# Altium schematic sheet 总图.SchDoc
size A3
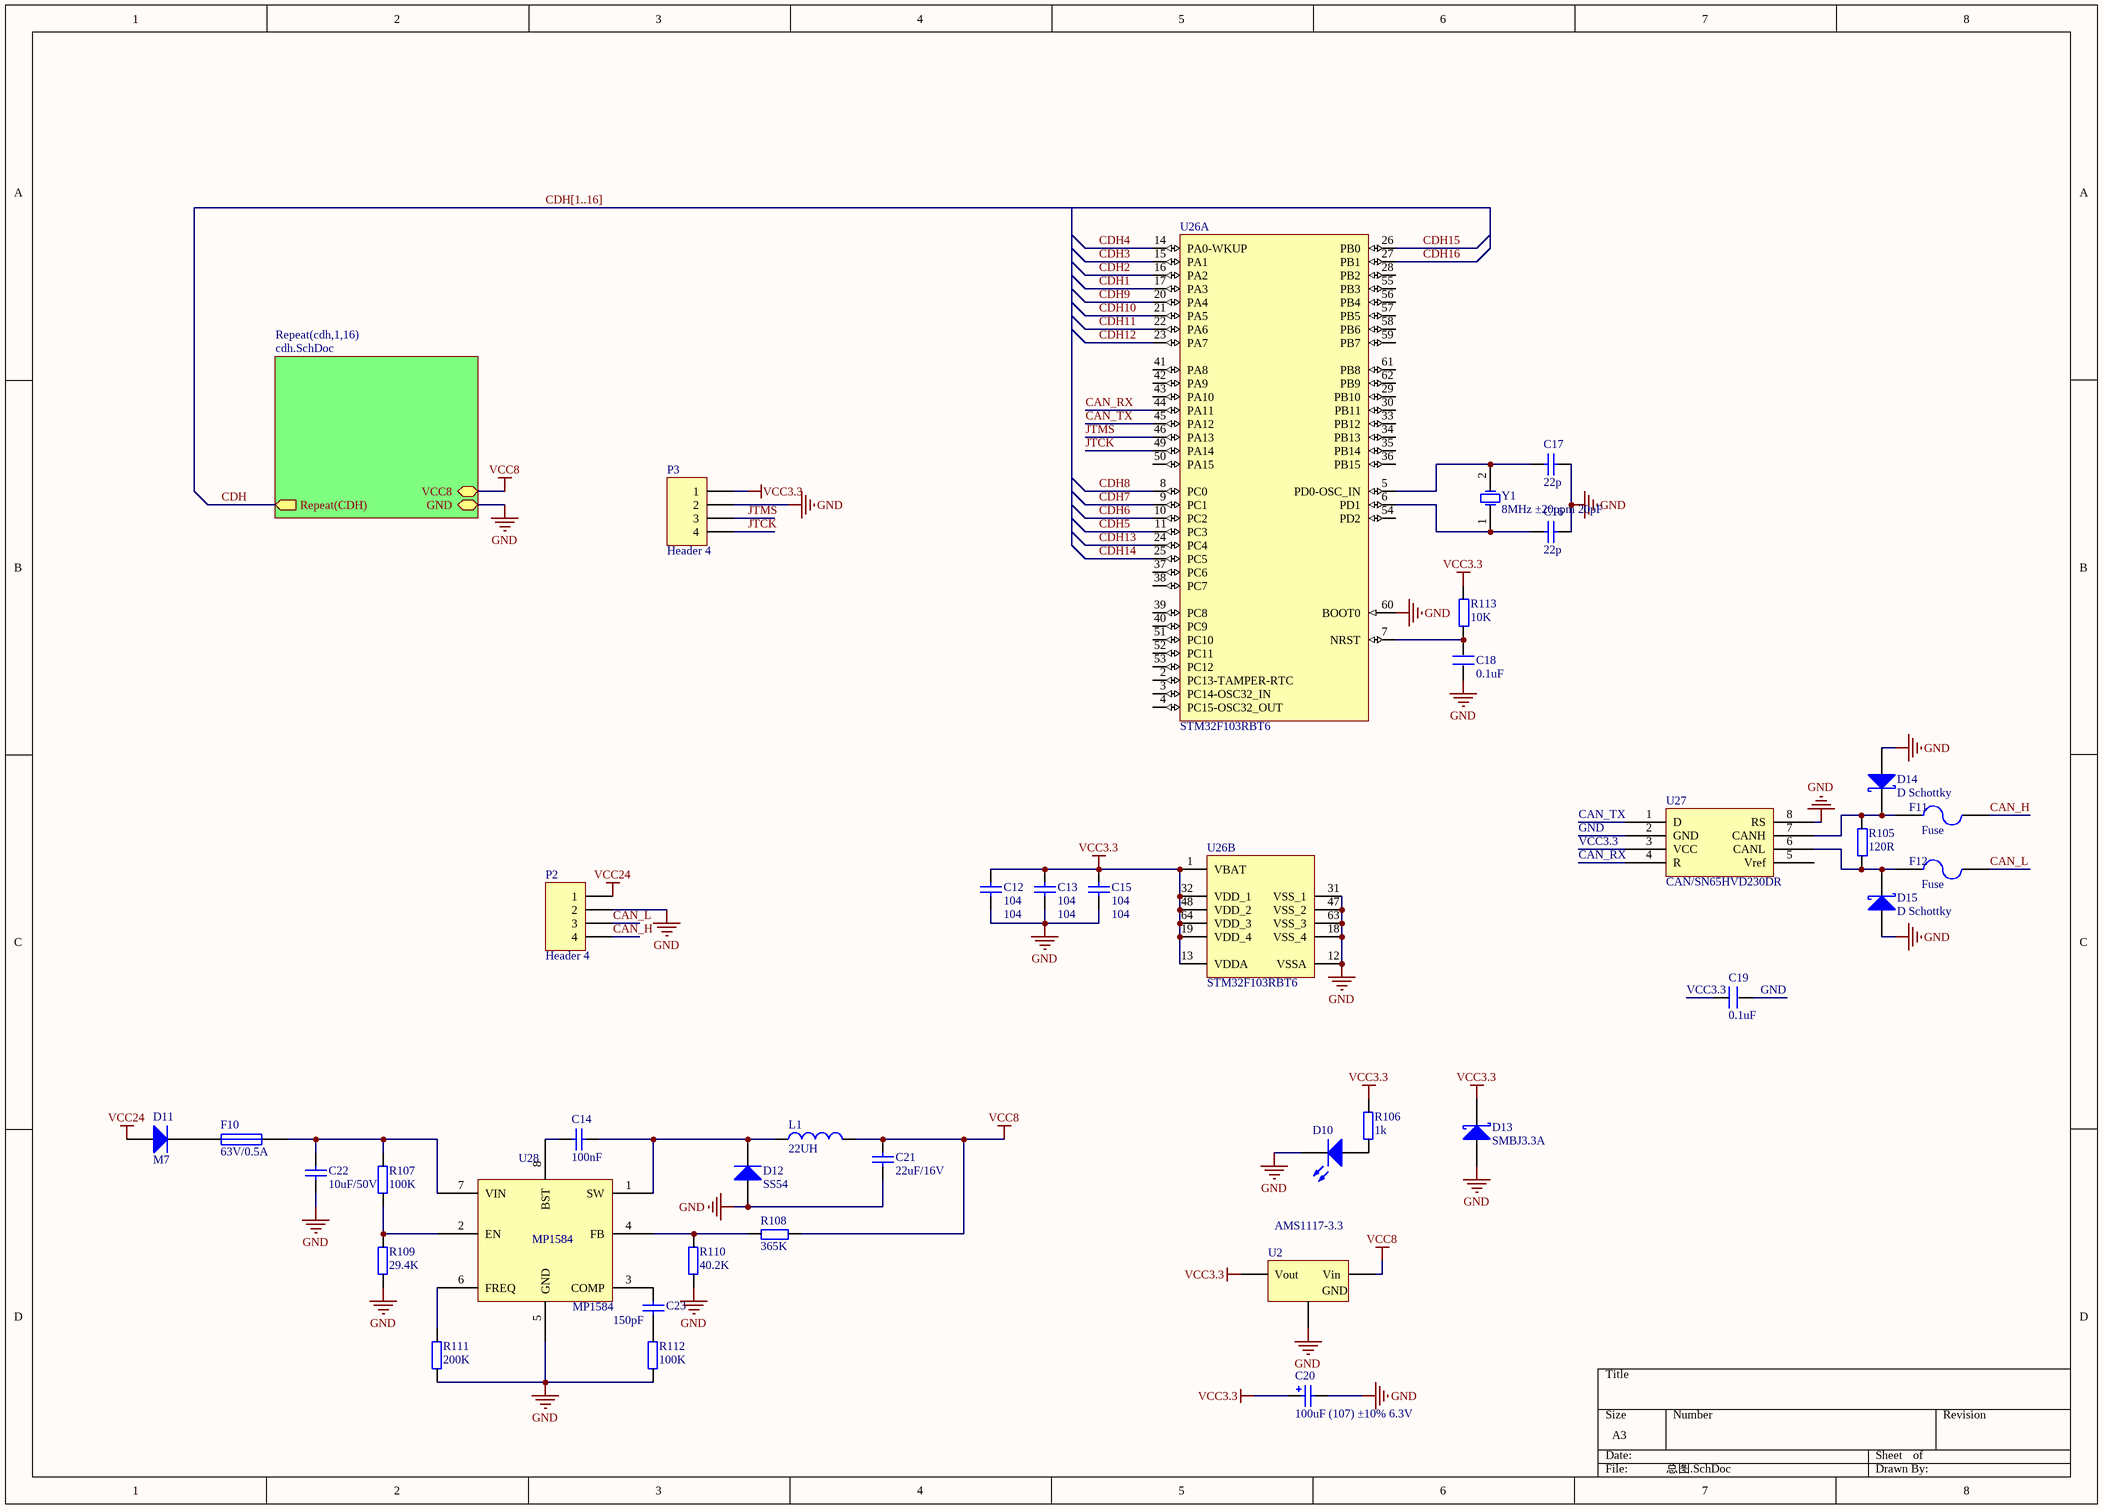
[diagram p0: 总图.SchDoc]

## Parts
C12  104  [0603-CAP]
C13  104  [0603-CAP]
C14  value 100nF  [0603-CAP]  (hidden comment: 0.1uF)
C15  104  [0603-CAP]
C16  22p  [0603-CAP]
C17  22p  [0603-CAP]
C18  0.1uF  [0603-CAP]
C19  0.1uF  [0603-CAP]
C20  100uF (107) ±10% 6.3V  [CASE-B_3528]
C21  value 22uF/16V  [1206]  (hidden comment: 0.1uF)
C22  value 10uF/50V  [1206]  (hidden comment: 0.1uF)
C23  value 150pF  [0603-CAP]  (hidden comment: 0.1uF)
D10  LED0  [LC-0805_LED_S1]  (value not drawn)
D11  M7  [SMA(DO-214AC)_S1]
D12  SS54  [SMA(DO-214AC)_S1]
D13  SMBJ3.3A  [SMB]
D14  D Schottky  [SMB]
D15  D Schottky  [SMB]
F10  63V/0.5A  [1206]
F11  Fuse  [12Z-2010]
F12  Fuse  [12Z-2010]
L1  22UH  [L-7*7*4mm-S]
P2  Header 4  [DZ-4-3.5]
P3  Header 4  [HDR1X4]
R105  120R  [0603]
R106  1k  [0603]
R107  100K  [0603]
R108  365K  [0603]
R109  29.4K  [0603]
R110  40.2K  [0603]
R111  200K  [0603]
R112  100K  [0603]
R113  10K  [0603]
U2  AMS1117-3.3  [SOT-223]
U26  STM32F103RBT6  [LQFP-64_10x10x05P]  (parts A,B of 2)
U27  CAN/SN65HVD230DR  [SOIC-8_150mil]
U28  MP1584  [SO-8]
Y1  8MHz ±20ppm 20pF  [SMD-5032_2P]

## Sub-sheets
Repeat(cdh,1,16) = cdh.SchDoc: GND (bidir), VCC8 (bidir), Repeat(CDH) (out)

## Nets
GND: C12.2 C13.2 C15.2 C16.2 C17.2 C18.1 C19.2 C20.2 C21.1 C22.2 D10.K D12.1(A) D13.1(A) D14.1(A) D15.1(A) P2.2 P3.2 R109.2 R110.2 R111.2 R112.2 U2.1(GND) U26.12(VSSA) U26.18(VSS_4) U26.31(VSS_1) U26.47(VSS_2) U26.60(BOOT0) U26.63(VSS_3) U27.2(GND) U27.8(RS) U28.5(GND) ; sheet Repeat(cdh,1,16)/GND
VCC3.3: C12.1 C13.1 C15.1 C19.1 C20.1 D13.2(K) P3.1 R106.1 R113.2 U2.2(Vout) U26.1(VBAT) U26.13(VDDA) U26.19(VDD_4) U26.32(VDD_1) U26.48(VDD_2) U26.64(VDD_3) U27.3(VCC)
VCC8: C21.2 L1.2 R108.2 U2.3(Vin) ; sheet Repeat(cdh,1,16)/VCC8
VCC24: D11.1(A) P2.1
CAN_H: F11.1 P2.4
CAN_L: F12.1 P2.3
CAN_RX: U26.44(PA11) U27.4(R)
CAN_TX: U26.45(PA12) U27.1(D)
CDH: sheet Repeat(cdh,1,16)/Repeat(CDH)
CDH1: U26.17(PA3)
CDH2: U26.16(PA2)
CDH3: U26.15(PA1)
CDH4: U26.14(PA0-WKUP)
CDH5: U26.11(PC3)
CDH6: U26.10(PC2)
CDH7: U26.9(PC1)
CDH8: U26.8(PC0)
CDH9: U26.20(PA4)
CDH10: U26.21(PA5)
CDH11: U26.22(PA6)
CDH12: U26.23(PA7)
CDH13: U26.24(PC4)
CDH14: U26.25(PC5)
CDH15: U26.26(PB0)
CDH16: U26.27(PB1)
JTCK: P3.4 U26.49(PA14)
JTMS: P3.3 U26.46(PA13)
NetC14_1: C14.1 D12.2(K) L1.1 U28.1(SW)
NetC14_2: C14.2 U28.8(BST)
NetC16_1: C16.1 U26.6(PD1) Y1.1(OSC1)
NetC17_1: C17.1 U26.5(PD0-OSC_IN) Y1.2(OSC2)
NetC18_2: C18.2 R113.1 U26.7(NRST)
NetC22_1: C22.1 F10.2 R107.1 U28.7(VIN)
NetC23_1: C23.1 R112.1
NetC23_2: C23.2 U28.3(COMP)
NetD10_A: D10.A R106.2
NetD11_2: D11.2(K) F10.1
NetD14_2: D14.2(K) F11.2 R105.2 U27.7(CANH)
NetD15_2: D15.2(K) F12.2 R105.1 U27.6(CANL)
NetR107_2: R107.2 R109.1 U28.2(EN)
NetR108_1: R108.1 R110.1 U28.4(FB)
NetR111_1: R111.1 U28.6(FREQ)

Not connected (* = marked no-connect by the designer): U26 2(PC13-TAMPER-RTC) 3(PC14-OSC32_IN) 4(PC15-OSC32_OUT) 28(PB2) 29(PB10) 30(PB11) 33(PB12) 34(PB13) 35(PB14) 36(PB15) 37(PC6) 38(PC7) 39(PC8) 40(PC9) 41(PA8) 42(PA9) 43(PA10) 50(PA15) 51(PC10) 52(PC11) 53(PC12) 54(PD2) 55(PB3) 56(PB4) 57(PB5) 58(PB6) 59(PB7) 61(PB8) 62(PB9); U27 5(Vref)

## Buses and harness runs
bus CDH[1..16]

## Library data of the parts
C12 C13 C15-C17 = Cap: Capacitor; Published: 8-Jun-2000; LatestRevisionDate: 17-Jul-2002; LatestRevisionNote: Re-released for DXP Platform.; PackageReference: RAD-0.3; Publisher: Altium Limited; PackageDescription: Radial Cap, Thru-Hole; 2 Leads; 0.3 in Pin Spacing
  C12 C13 C15: Value: 104
  C16 C17: Value: 22p
C14 C21-C23 = Cap Semi: Capacitor (Semiconductor SIM Model); Published: 8-Jun-2000; LatestRevisionDate: 29-May-2009; LatestRevisionNote: IPC-7351 Footprint Added.; PackageReference: C1206; Publisher: Altium Limited; PackageDescription: Chip Capacitor
C18 = C
C19 = C_3
C20 = 3528 100uF (107) 10% 6.3V: 钽电容; ComponentLink1Description: 供应商链接; ComponentLink1URL: http://www.szlcsc.com/product/details_16815.html; Package: 3528; Supplier: LC; SuppliersPartNumber: C16133
D10 = LED0: Typical INFRARED GaAs LED; Published: 8-Jun-2000; LatestRevisionDate: 08-Jul-2005; LatestRevisionNote: Mech Layer 1 removed.; PackageReference: LED-0; Publisher: Altium Limited; PackageDescription: LED; 2 Leads
D11 = SMA(DO-214AC) M7: 二极管; 备注: 1N4007 4007 编号C2464 已经停售, 使用新物料编号C95872; ComponentLink1Description: 供应商链接; ComponentLink1URL: http://www.szlcsc.com/product/details_2841.html; Package: SMA(DO-214AC); Supplier: LC; SuppliersPartNumber: C95872
D12 = SMA(DO-214AC) SS54: 二极管; ComponentLink1Description: 供应商链接; ComponentLink1URL: http://www.szlcsc.com/product/details_23178.html; Package: SMA(DO-214AC); Supplier: LC; SuppliersPartNumber: C22452
D13-D15 = D Schottky: Schottky Diode; Published: 8-Jun-2000; LatestRevisionDate: 17-Jul-2002; LatestRevisionNote: Re-released for DXP Platform.; PackageReference: SMB; Publisher: Altium Limited; PackageDescription: DO-214-AA/SMB; 2 C-Bend Leads; Body 5.3 x 3.6 mm, inc. leads (LxW); Code_JEDEC: DO-214-AA
F10 = Fuse 1: Fuse; Published: 8-Jun-2000; LatestRevisionDate: 17-Jul-2002; LatestRevisionNote: Re-released for DXP Platform.; PackageReference: PIN-W2/E2.8; Publisher: Altium Limited; PackageDescription: Thru-Hole; 2 Leads
F11 F12 = Fuse 2: Published: 8-Jun-2000; LatestRevisionDate: 17-Jul-2002; LatestRevisionNote: Re-released for DXP Platform.; PackageReference: PIN-W2/E2.8; Publisher: Altium Limited; PackageDescription: Thru-Hole; 2 Leads
L1 = Inductor: Code_IEC: 1005; Published: 8-Jun-2000; LatestRevisionDate: 29-May-2009; LatestRevisionNote: IPC-7351 Footprint Added.; PackageReference: 0402-A; Publisher: Altium Limited; PackageDescription: Chip Inductor; Code_JEITA: 0402; Value: 22uH
P2 P3 = Header 4: Header, 4-Pin; LatestRevisionDate: 17-Jul-2002; LatestRevisionNote: Re-released for DXP Platform.; Publisher: Altium Limited
R105-R113 = R_2
U2 = SOT-223 AMS1117-3.3: 低压差线性稳压(LDO); ComponentLink1Description: 供应商链接; ComponentLink1URL: http://www.szlcsc.com/product/details_6652.html; Package: SOT-223; Supplier: LC; SuppliersPartNumber: C6186
U26 = STM32F103RBT6: ARM; ComponentLink1Description: 供应商链接; ComponentLink1URL: http://www.szlcsc.com/product/details_9244.html; Package: LQFP-64_10x10x05P; Supplier: LC; SuppliersPartNumber: C8735
U27 = CAN/SN65HVD230DR_[C12084]: CAN; ComponentLink1Description: 供应商链接; ComponentLink1URL: http://www.szlcsc.com/product/details_12661.html; Package: SOIC-8_150mil; Supplier: LC; SuppliersPartNumber: C12084
U28 = MP1584EN
Y1 = SMD-5032_2P 8MHz 20ppm 20pF: 贴片晶振; ComponentLink1Description: 供应商链接; ComponentLink1URL: http://www.szlcsc.com/product/details_117214.html; Package: SMD-5032_2P; Supplier: LC; SuppliersPartNumber: C115962